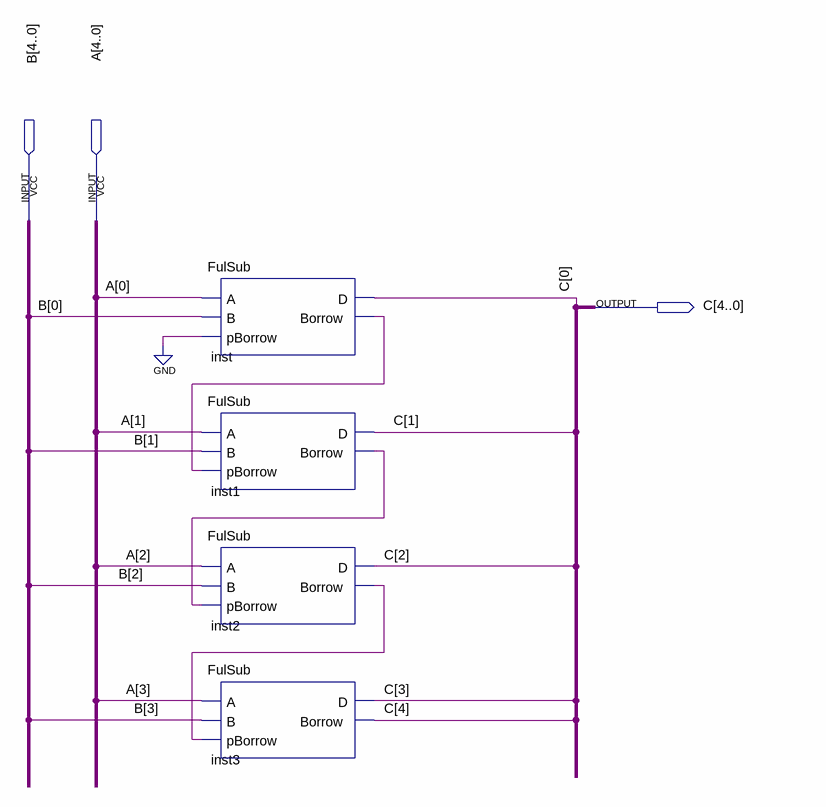
[diagram p0: schematic sheet]
// Quartus schematic SubAB.bdf as structural Verilog: 4 symbols, 3 pins
module SubAB (
  input  [4:0] B,
  input  [4:0] A,
  output [4:0] C
);

  wire inst1_borrow, inst2_borrow, inst_borrow;

  FulSub inst (.A(A[0]), .B(B[0]), .pBorrow(1'b0), .D(C[0]), .Borrow(inst_borrow));
  FulSub inst1 (.A(A[1]), .B(B[1]), .pBorrow(inst_borrow), .D(C[1]), .Borrow(inst1_borrow));
  FulSub inst2 (.A(A[2]), .B(B[2]), .pBorrow(inst1_borrow), .D(C[2]), .Borrow(inst2_borrow));
  FulSub inst3 (.A(A[3]), .B(B[3]), .pBorrow(inst2_borrow), .D(C[3]), .Borrow(C[4]));
endmodule
